# EAGLE schematic OCT19 (EAGLE 7.7.0)
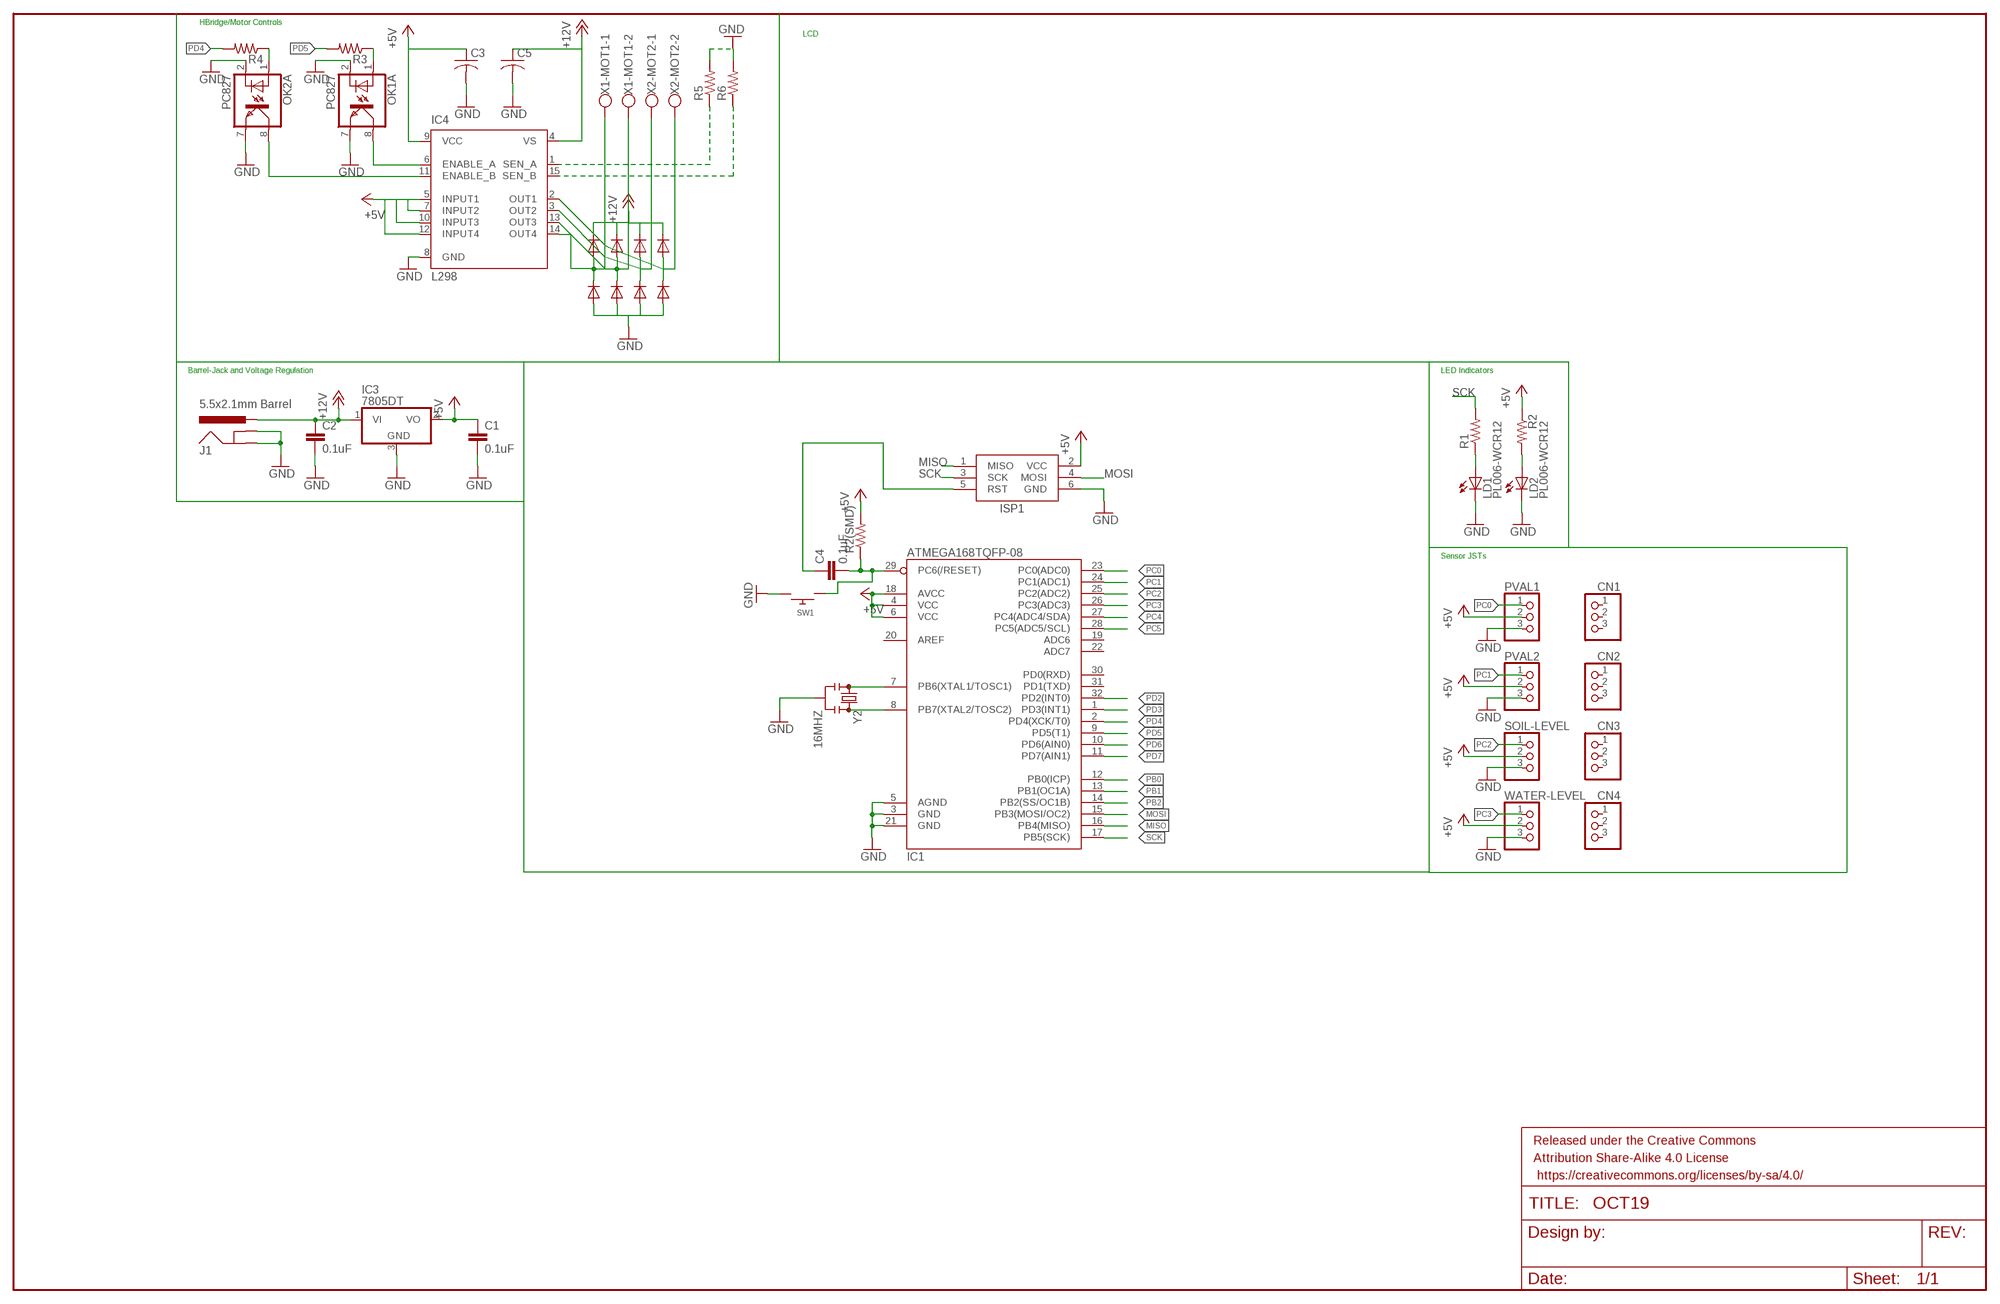
[diagram p0: schematic, sheet 1]

## Parts
C1  0.1uF  0.1UF-25V(+80/-20%)(0603)  [0603-CAP]
C2  0.1uF  0.1UF-25V(+80/-20%)(0603)  [0603-CAP]
C3  C-US025-024X044  [C025-024X044]
C4  0.1uF  0.1UF-25V(+80/-20%)(0603)  [0603-CAP]
C5  C-US025-024X044  [C025-024X044]
CN1  JST_3PIN  [JSTPH3]
CN2  JST_3PIN  [JSTPH3]
CN3  JST_3PIN  [JSTPH3]
CN4  JST_3PIN  [JSTPH3]
FRAME1  FRAME-LEDGER  [CREATIVE_COMMONS]
IC1  ATMEGA168TQFP-08  [TQFP32-08]
IC3  7805DT  [TO252]
IC4  L298  [MULTIWATT-15]
ISP1  AVRISP-6  [AVRISP]
J1  5.5x2.1mm Barrel  POWER_JACKSMD  [POWER_JACK_SMD]
LD1  PL006-WCR12  [SOT23]
LD2  PL006-WCR12  [SOT23]
OK1  PC827  [DIL08]
OK2  PC827  [DIL08]
PVAL1  JST_3PIN  [JSTPH3]
PVAL2  JST_3PIN  [JSTPH3]
R1  R-US_M0805  [M0805]
R2  R-US_M0805  [M0805]
R2(SMD)  R-US_M0805  [M0805]
R3  R-US_M0805  [M0805]
R4  R-US_M0805  [M0805]
R5  R-US_M0805  [M0805]
R6  R-US_M0805  [M0805]
SOIL-LEVEL  JST_3PIN  [JSTPH3]
SW1  SWITCH_PUSHBUTTONC&K_KSS  [BTN_CK_KSS]
WATER-LEVEL  JST_3PIN  [JSTPH3]
X1-MOT1  W237-102  [W237-102]
X2-MOT2  W237-102  [W237-102]
Y2  16MHZ  RESONATOR16MHZ  [RESONATOR-SMD]

## Nets
+5V: C1.1 C3.1 IC1.4(VCC) IC1.6(VCC) IC1.18(AVCC) IC3.2(VO) IC4.5(INPUT1) IC4.7(INPUT2) IC4.9(VCC) IC4.10(INPUT3) IC4.12(INPUT4) ISP1.2(VCC) PVAL1.2 PVAL2.2 R2(SMD).2 R2.1 SOIL-LEVEL.2 WATER-LEVEL.2
+12V: C2.1 C5.1 IC3.1(VI) IC4.4(VS) J1.VIN0(PWR)
GND: C1.2 C2.2 C3.2 C5.2 IC1.3(GND) IC1.5(AGND) IC1.21(GND) IC3.3(GND) IC4.8(GND) ISP1.6(GND) J1.GND(GNDBREAK) J1.P$4(GND) LD1.3(C) LD2.3(C) OK1.2(A:C) OK1.7(A:EMIT) OK2.2(A:C) OK2.7(A:EMIT) PVAL1.3 PVAL2.3 R5.2 R6.2 SOIL-LEVEL.3 SW1.P$2 WATER-LEVEL.3 Y2.2
MISO: IC1.16(PB4(MISO)) ISP1.1(MISO)
MOSI: IC1.15(PB3(MOSI/OC2)) ISP1.4(MOSI)
N$1: C4.2 IC1.29(PC6(/RESET)) R2(SMD).1 SW1.P$1
N$2: LD2.1(A) R2.2
N$3: OK1.1(A:A) R3.1
N$4: IC4.6(ENABLE_A) OK1.8(A:COL)
N$5: OK2.1(A:A) R4.1
N$6: IC4.11(ENABLE_B) OK2.8(A:COL)
N$7: IC4.2(OUT1) X2-MOT2.2
N$8: IC4.13(OUT3) X1-MOT1.2
N$9: IC4.14(OUT4) X1-MOT1.1
N$10: LD1.1(A) R1.1
N$11: IC1.7(PB6(XTAL1/TOSC1)) Y2.1
N$13: IC4.1(SEN_A) R5.1
N$14: IC4.15(SEN_B) R6.1
N$15: IC4.3(OUT2) X2-MOT2.1
N$16: IC1.8(PB7(XTAL2/TOSC2)) Y2.3
N$17: C4.1 ISP1.5(RST)
PB0: IC1.12(PB0(ICP))
PB1: IC1.13(PB1(OC1A))
PB2: IC1.14(PB2(SS/OC1B))
PC0: IC1.23(PC0(ADC0)) PVAL1.1
PC1: IC1.24(PC1(ADC1)) PVAL2.1
PC2: IC1.25(PC2(ADC2)) SOIL-LEVEL.1
PC3: IC1.26(PC3(ADC3)) WATER-LEVEL.1
PC4: IC1.27(PC4(ADC4/SDA))
PC5: IC1.28(PC5(ADC5/SCL))
PD2: IC1.32(PD2(INT0))
PD3: IC1.1(PD3(INT1))
PD4: IC1.2(PD4(XCK/T0)) R4.2
PD5: IC1.9(PD5(T1)) R3.2
PD6: IC1.10(PD6(AIN0))
PD7: IC1.11(PD7(AIN1))
SCK: IC1.17(PB5(SCK)) ISP1.3(SCK) R1.2
Unconnected: CN1.1 CN1.2 CN1.3 CN2.1 CN2.2 CN2.3 CN3.1 CN3.2 CN3.3 CN4.1 CN4.2 CN4.3 IC1.19(ADC6) IC1.20(AREF) IC1.22(ADC7) IC1.30(PD0(RXD)) IC1.31(PD1(TXD)) OK1.3(B:A) OK1.4(B:C) OK1.5(B:EMIT) OK1.6(B:COL) OK2.3(B:A) OK2.4(B:C) OK2.5(B:EMIT) OK2.6(B:COL)

## Notes on the sheet
- HBridge/Motor Controls
- LCD
- Barrel-Jack and Voltage Regulation | LED Indicators
- Sensor JSTs

## Library data of the parts
C1 C2 C4 = SparkFun-Capacitors:0.1UF-25V(+80/-20%)(0603): CAP-00810 Ceramic Standard decoupling cap; PROD_ID: CAP-00810
C3 C5 = adafruit:C-US: CAPACITOR, American symbol
CN1-CN4 PVAL1 PVAL2 SOIL-LEVEL WATER-LEVEL = adafruit:JST_3PIN
FRAME1 = SparkFun-Aesthetics:FRAME-LEDGER: Schematic Frame Standard 11x14 US Ledger frame
IC1 = atmega328p:ATMEGA168
IC3 = adafruit:78*: Positive VOLTAGE REGULATOR Added bigger pads to the TO-92 package
IC4 = st-microelectronics:L298: DUAL FULL-BRIDGE DRIVER; MPN: L298N; OC_FARNELL: 1589425; OC_NEWARK: 32M1527
ISP1 = adafruit:AVRISP: AVR ISP HEADER Standard 6 pin header for AVR programming
J1 = SparkFun-Connectors:POWER_JACK: Power Jack This is the standard 5.5mm barrel jack for power. The PTH is the most common, proven, reliable, footprint. The Slot footprint only works if the mill layer is transmitted to the PCB fab house so be warned. Mating wall wart : TOL-00298 (and others); PROD_ID: CONN-08106; SF_ID: PRT-12748
LD1 LD2 = led:PL006*: PLH006 Series SMD LED SOT23 PLH006-WCR21 Super Red PLH006-WCR12 High Eff Red PLH006-WCG13 Green PLH006-WCY01 Yellow www.p-tec.net Source: http://www.wittig-electronic.de/PTEC/PL006Series.pdf
OK1 OK2 = optocoupler:PC827: SHARP OPTO COUPLER; OC_FARNELL: unknown; OC_NEWARK: unknown
R1 R2 R2(SMD) R3-R6 = adafruit:R-US_: RESISTOR, American symbol
SW1 = adafruit:SWITCH_PUSHBUTTON: Buttons SOFTTOUCHSMD_SJ - Soft touch temporary push button (Super Junk Akihabara) Compatible with SKPMANE010 [Mouser: 688-SKPMAN] C&K_KSS = Digikey: KSS221GLFS
X1-MOT1 X2-MOT2 = con-wago-500:W237-102: WAGO SCREW CLAMP; MPN: 237-102; OC_FARNELL: unknown; OC_NEWARK: 70K9898
Y2 = SparkFun-FreqCtrl:RESONATOR: Resonator Small SMD resonator. Used, eg, on the Arduino Pro/ Pro Mini boards. 8MHz- XTAL-08895 16MHz- XTAL-08900; PROD_ID: XTAL-08900